# Altium schematic sheet [02] - BLOCK DIAGRAM.SchDoc
size A3; DocumentNumber: 2; SheetNumber: 2; SheetTotal: 5
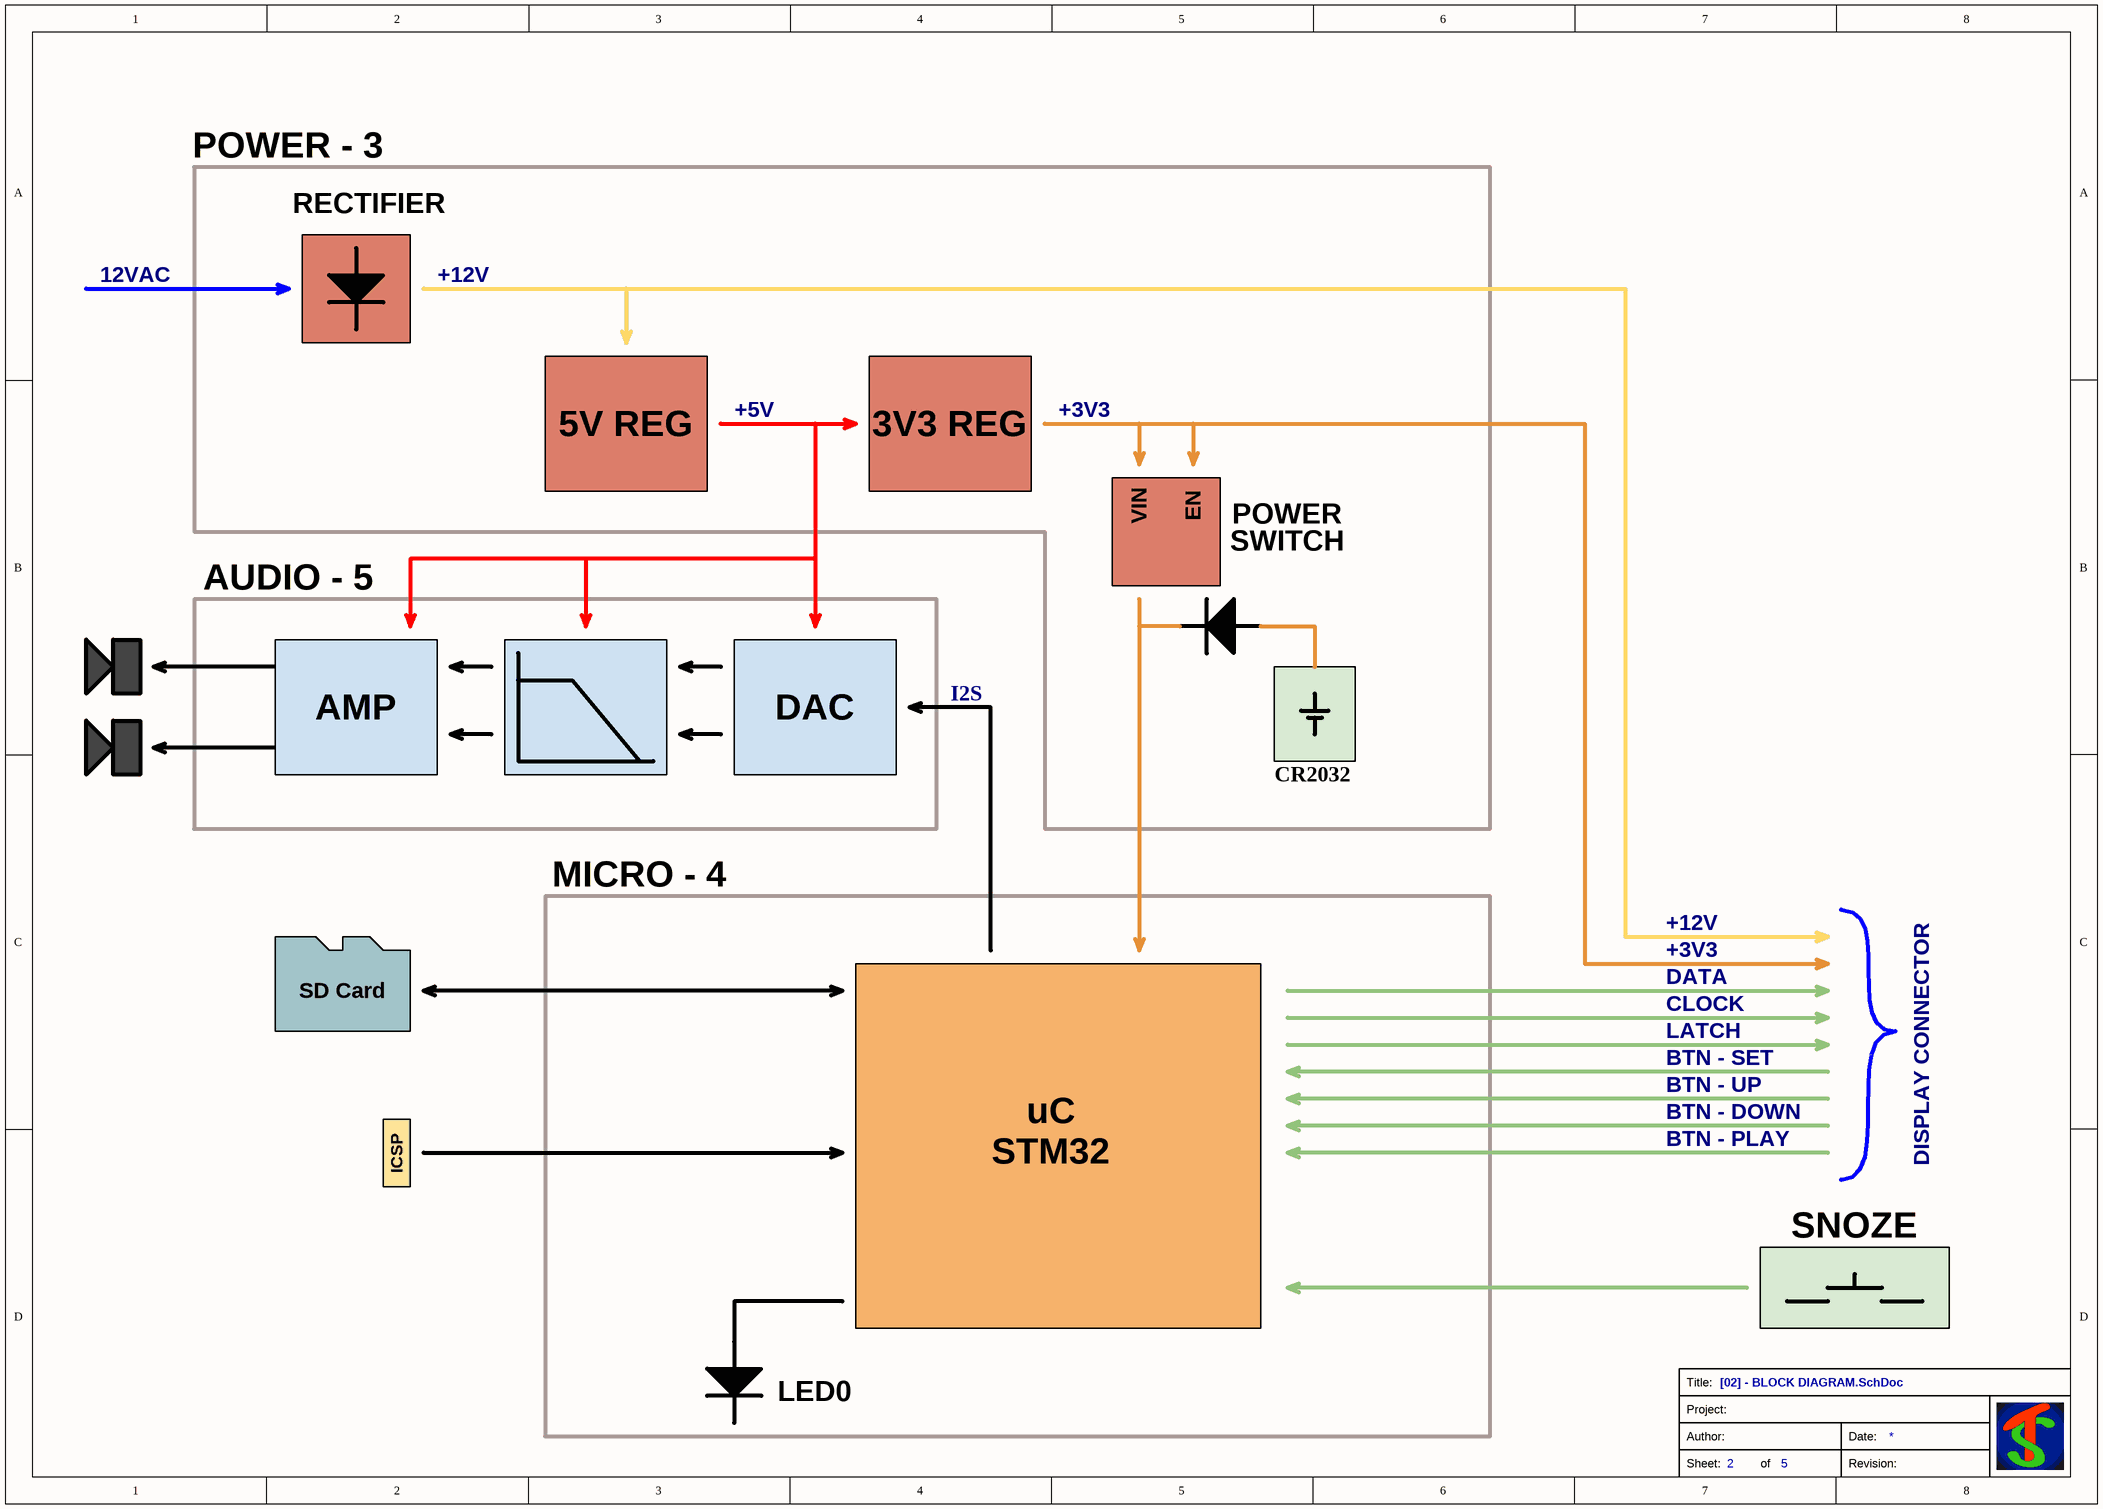
[diagram p0: [02] - BLOCK DIAGRAM.SchDoc]

## Notes on the sheet
- POWER - 3
- RECTIFIER
- 12VAC
- +12V
- 5V REG
- +5V
- 3V3 REG
- +3V3
- VIN
- EN
- SWITCH
- POWER
- AUDIO - 5
- AMP
- DAC
- I2S
- CR2032
- MICRO - 4
- SD Card
- DATA
- CLOCK
- LATCH
- uC
- BTN - SET
- BTN - UP
- BTN - DOWN
- ICSP
- STM32
- BTN - PLAY
- DISPLAY CONNECTOR
- SNOZE
- LED0
- Title:
- Project:
- Sheet:
- Author:
- of
- Revision:
- Date: